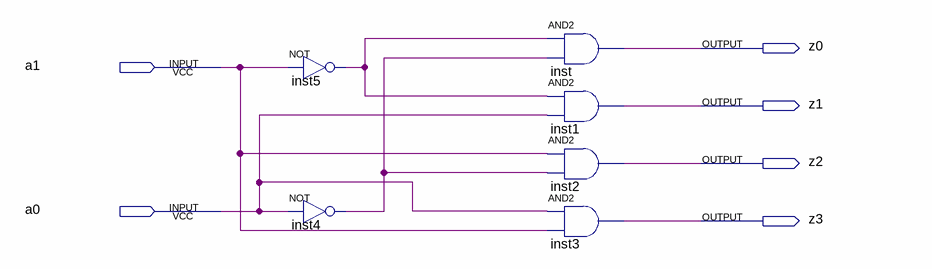
[diagram p0: schematic sheet]
// Quartus schematic 2-4Decoder.bdf as structural Verilog: 6 symbols, 6 pins
module \2-4Decoder  (
  input  a1,
  input  a0,
  output z0,
  output z1,
  output z2,
  output z3
);

  wire inst4_out, inst5_out;

  not inst5 (inst5_out, a1);
  not inst4 (inst4_out, a0);
  and inst (z0, inst5_out, inst4_out);
  and inst1 (z1, inst5_out, a0);
  and inst2 (z2, a1, inst4_out);
  and inst3 (z3, a0, a1);
endmodule
